# Altium project MIL_STD_1275D_PROTECTION.PrjPcb (part 2 of 4)
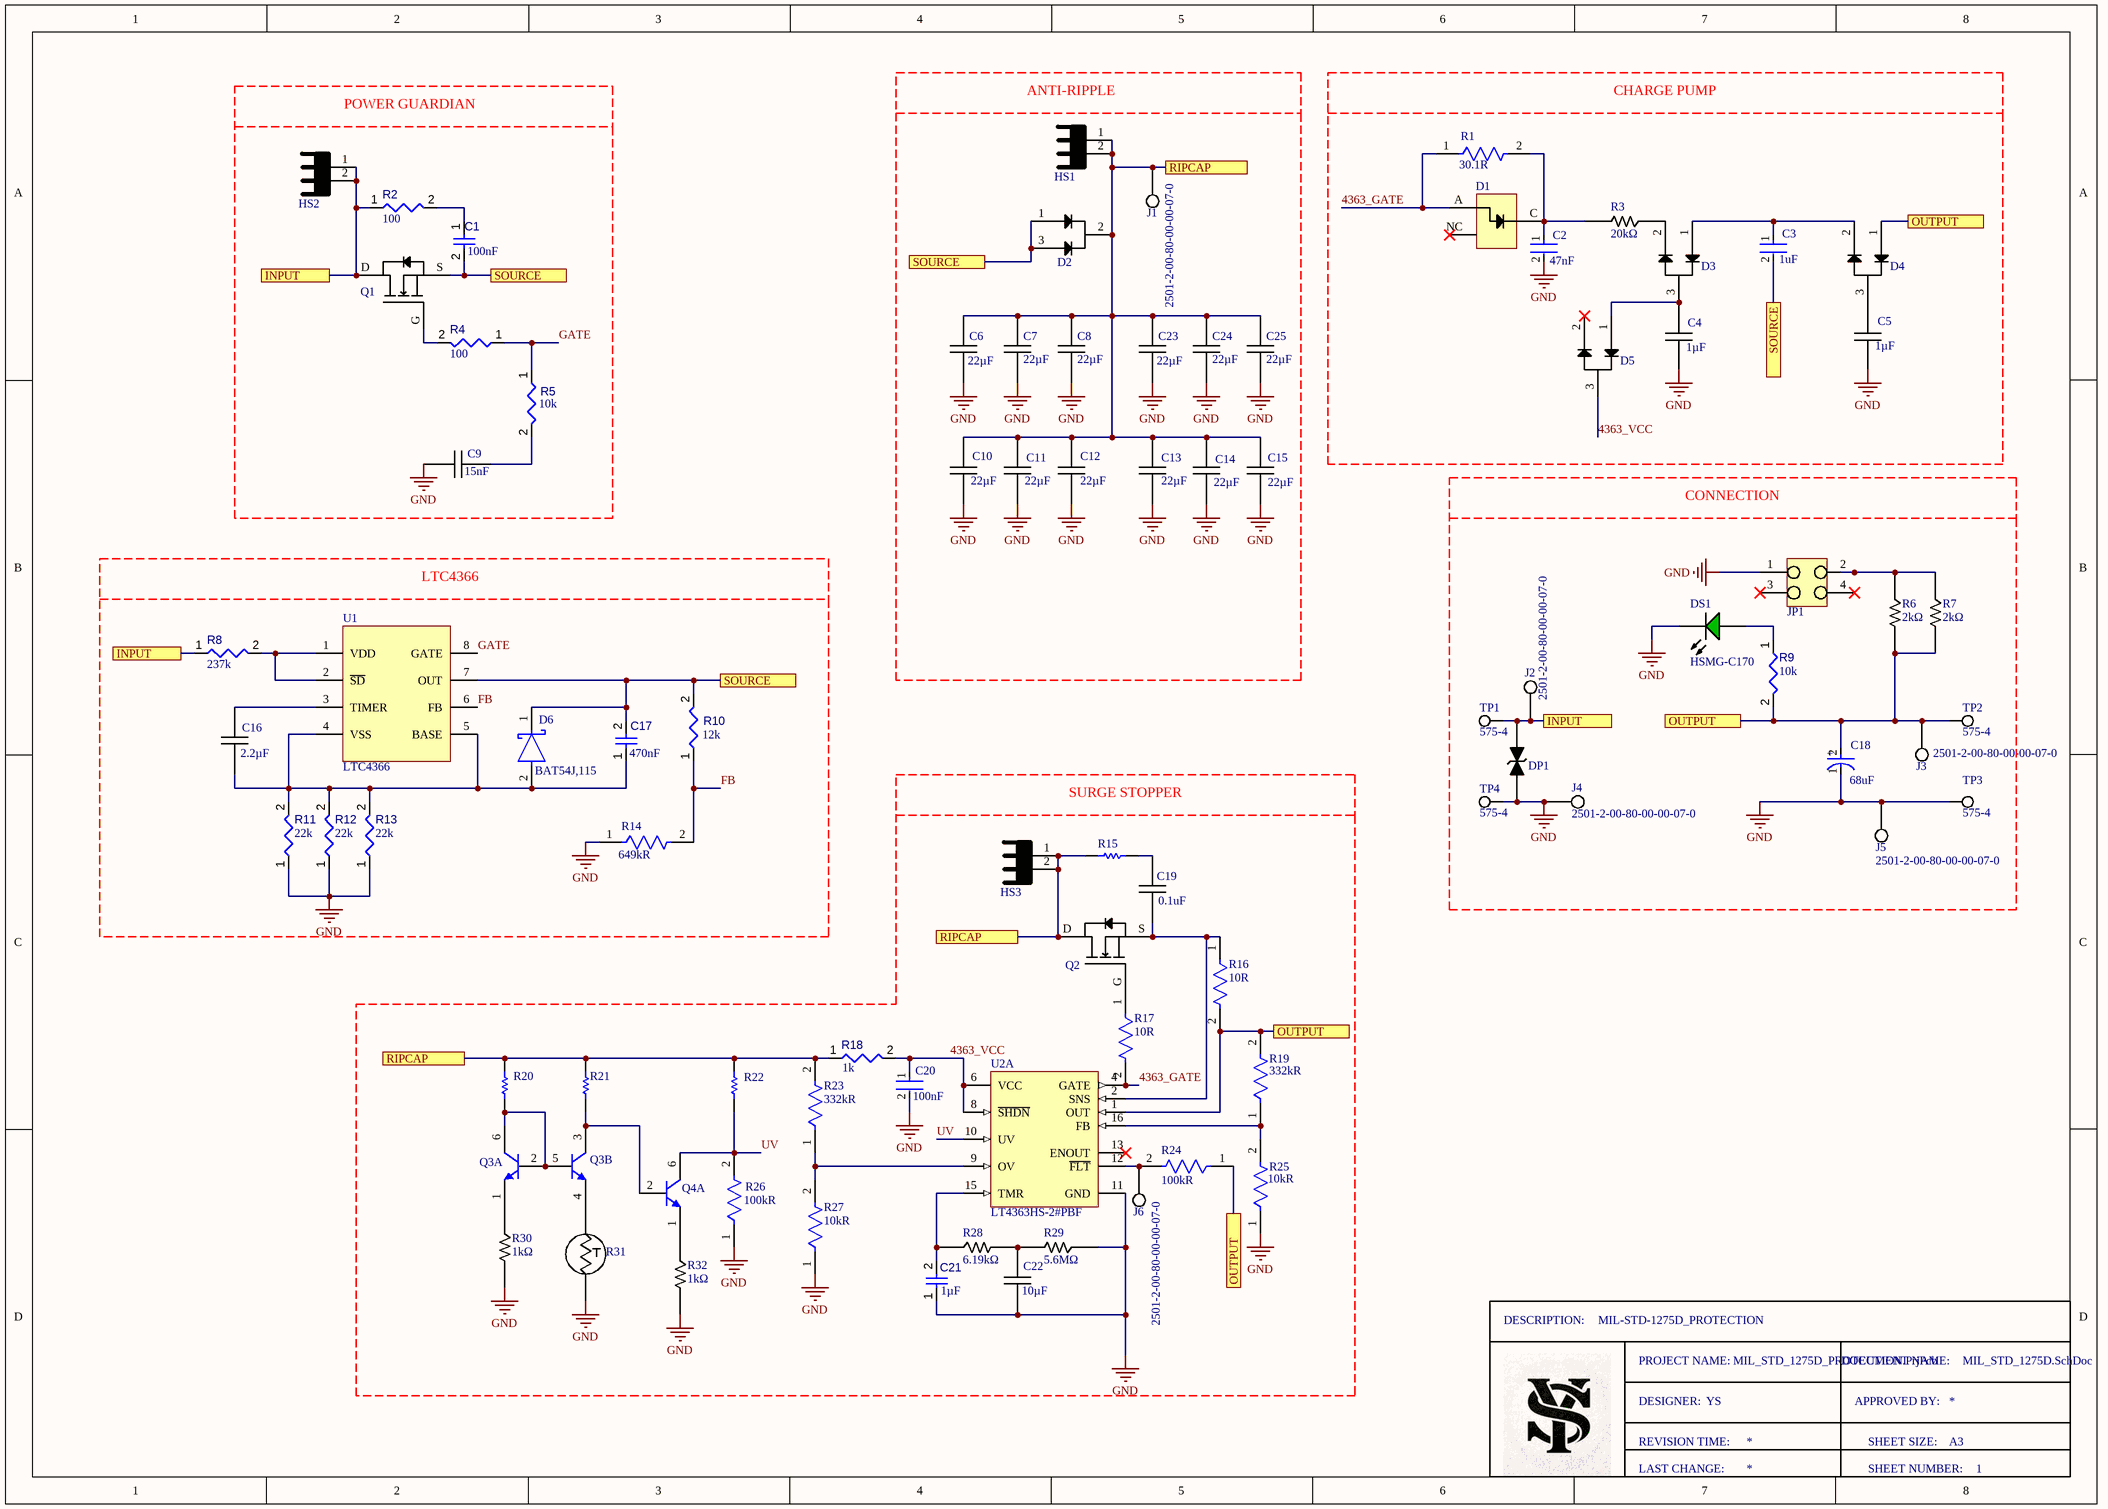
[diagram p1: MIL_STD_1275D.SchDoc]

## Sheet MIL_STD_1275D.SchDoc: MIL-STD-1275D_PROTECTION (continued)
### Library data of the parts
C1 = CMP-001-00065-4: Chip Capacitor, 100nF +/-20%, 25V, 0402, Thickness 0.6 mm; Tolerance: 10%; Max Operating Temperature: 85°C; Min Operating Temperature: -55°C; Pins: 2; Voltage Rating: 25V; Mounting Technology: SMT; Case/Package: 0402
C2 = CMP-08246-006986-1: Multilayer Ceramic Capacitors 47nF ±10% 100V X7R SMD 0805; Height: 1.25mm; Thickness: 0.057inch; Series: C; Case Code (Imperial): 0805; Voltage: 100V; Number of Pins: 2; Termination: SMD/SMT; Lead Free: Lead Free; Package Quantity: 1; Packaging: Tape and Reel; Dielectric: X7R; Resistor Type: Ceramic; RoHS Compliant: Yes; Case Code (Metric): 2012; REACH SVHC: No SVHC; Length: 2mm; Mount: Surface Mount; Depth: 1.25mm; Voltage Rating: 100V; Voltage Rating (DC): 100V; Case/Package: 0805; Tolerance: 10%; Weight: 0.000194oz; Min Operating Temperature: -55°C; Width: 0.049inch; Max Operating Temperature: 125°C
C3 = CMP-08246-007020-1: Multilayer Ceramic Capacitors 1uF ±10% 250V X7R SMD 2220; Voltage Rating (DC): 250V; Case Code (Metric): 5750; Min Operating Temperature: -55°C; REACH SVHC: No SVHC; Max Operating Temperature: 125°C; Height: 2.3mm; Voltage Rating: 250V; Dielectric: X7R; Lead Free: Lead Free; Number of Pins: 2; Termination: SMD/SMT; Length: 5.7mm; Case Code (Imperial): 2220; Mount: Surface Mount; Width: 0.197inch; RoHS Compliant: Yes; Thickness: 0.098inch; Radiation Hardening: No; Tolerance: 10%; Weight: 0.016932oz; Voltage: 250V; Package Quantity: 1; Packaging: Tape and Reel; Resistor Type: Ceramic; Case/Package: 2220; Series: C; Depth: 5mm
C4 C5 = C5750X7R2E105K230KA: 250V 1uF X7R 卤10% 2220 Multilayer Ceramic Capacitors MLCC - SMD/SMT ROHS; Manufacturer: TDK; Manufacturer Lifecycle Status: PRODUCTION; Tolerance: 10%; Designed by: YS; Supplier: Mouser; Supplier Part Number: 810-C5750X7R2E105K; Manufacturer Part Number: C5750X7R2E105K230KA; RoHS: Compliant; Category: Ceramic Capacitors; Stock: 10975; Pricing: 1=1,18, 10=0,601, 50=0,601, 100=0,55, 1000=0,411, 10000=0,38 (USD); Case/Package: 2220; Case Code (Imperial): 2220; Case Code (Metric): 5750; China RoHS: Compliant; Composition: Ceramic; Depth: 5mm; Dielectric: X7R; Dielectric Material: Ceramic; Height: 2.3mm; Lead Free: Lead Free; Length: 5.7mm; Lifecycle Status: Production; Material: Ceramic; Max Length: 6.1mm; Max Operating Temperature: 125°C; Max Width: 5.4mm; Min Length: 5.3mm; Min Operating Temperature: -55°C; Min Width: 4.6mm; Mounting Technology: Surface Mount; Pins: 2; Number of Terminals: 2; Radiation Hardening: No; REACH SVHC: Yes; Schedule B: 8532240020, 8532240020|8532240020|8532240020|8532240020|8532240020; Termination: SMD/SMT; Thickness: 2.4892mm; Voltage: 250V; Voltage Rating: 250V; Voltage Rating (DC): 250V; Weight: 480.014126mg; Width: 5mm; ComponentLink1URL: https://datasheet.octopart.com:443/C5750X7R2E105K230KA-TDK-datasheet-159617022.pdf?src-supplier=IHS; ComponentLink1Description: https://datasheet.octopart.com:443/C5750X7R2E105K230KA-TDK-datasheet-159617022.pdf?src-supplier=IHS; ComponentLink2URL: https://datasheet.octopart.com:443/C5750X7R2E105K230KA-TDK-datasheet-151546522.pdf?src-supplier=TDK; ComponentLink2Description: https://datasheet.octopart.com:443/C5750X7R2E105K230KA-TDK-datasheet-151546522.pdf?src-supplier=TDK; ComponentLink3URL: https://datasheet.octopart.com:443/C5750X7R2E105K230KA-TDK-datasheet-43914167.pdf?src-supplier=Newark; ComponentLink3Description: https://datasheet.octopart.com:443/C5750X7R2E105K230KA-TDK-datasheet-43914167.pdf?src-supplier=Newark; ComponentLink4URL: https://datasheet.octopart.com:443/C5750X7R2E105K230KA-TDK-datasheet-13376850.pdf?src-supplier=Newark; ComponentLink4Description: https://datasheet.octopart.com:443/C5750X7R2E105K230KA-TDK-datasheet-13376850.pdf?src-supplier=Newark; ComponentLink5URL: https://datasheet.octopart.com:443/C5750X7R2E105K230KA-TDK-datasheet-41194876.pdf?src-supplier=Newark; ComponentLink5Description: https://datasheet.octopart.com:443/C5750X7R2E105K230KA-TDK-datasheet-41194876.pdf?src-supplier=Newark; ComponentLink6URL: https://datasheet.octopart.com:443/C5750X7R2E105K230KA-TDK-datasheet-8852320.pdf?src-supplier=Newark; ComponentLink6Description: https://datasheet.octopart.com:443/C5750X7R2E105K230KA-TDK-datasheet-8852320.pdf?src-supplier=Newark; ComponentLink7URL: https://datasheet.octopart.com:443/C5750X7R2E105K230KA-TDK-datasheet-10497308.pdf?src-supplier=Newark; ComponentLink7Description: https://datasheet.octopart.com:443/C5750X7R2E105K230KA-TDK-datasheet-10497308.pdf?src-supplier=Newark; ComponentLink8URL: https://datasheet.octopart.com:443/C5750X7R2E105K230KA-TDK-datasheet-11980753.pdf?src-supplier=element14+APAC; ComponentLink8Description: https://datasheet.octopart.com:443/C5750X7R2E105K230KA-TDK-datasheet-11980753.pdf?src-supplier=element14+APAC; ComponentLink9URL: https://datasheet.octopart.com:443/C5750X7R2E105K230KA-TDK-datasheet-182135025.pdf?src-supplier=TME; ComponentLink9Description: https://datasheet.octopart.com:443/C5750X7R2E105K230KA-TDK-datasheet-182135025.pdf?src-supplier=TME; ComponentLink10URL: https://datasheet.octopart.com:443/C5750X7R2E105K230KA-TDK-datasheet-154543791.pdf?src-supplier=ODG+(Origin+Data+Global); ComponentLink10Description: https://datasheet.octopart.com:443/C5750X7R2E105K230KA-TDK-datasheet-154543791.pdf?src-supplier=ODG+(Origin+Data+Global); ComponentLink11URL: https://datasheet.octopart.com:443/C5750X7R2E105K230KA-TDK-datasheet-12509848.pdf?src-supplier=Future+Electronics; ComponentLink11Description: https://datasheet.octopart.com:443/C5750X7R2E105K230KA-TDK-datasheet-12509848.pdf?src-supplier=Future+Electronics; ComponentLink12URL: https://datasheet.octopart.com:443/C5750X7R2E105K230KA-TDK-datasheet-10978788.pdf?src-supplier=Future+Electronics; ComponentLink12Description: https://datasheet.octopart.com:443/C5750X7R2E105K230KA-TDK-datasheet-10978788.pdf?src-supplier=Future+Electronics; ComponentLink13URL: https://datasheet.octopart.com:443/C5750X7R2E105K230KA-TDK-datasheet-8359770.pdf?src-supplier=Future+Electronics; ComponentLink13Description: https://datasheet.octopart.com:443/C5750X7R2E105K230KA-TDK-datasheet-8359770.pdf?src-supplier=Future+Electronics; ComponentLink14URL: https://datasheet.octopart.com:443/C5750X7R2E105K230KA-TDK-datasheet-8324322.pdf?src-supplier=Future+Electronics; ComponentLink14Description: https://datasheet.octopart.com:443/C5750X7R2E105K230KA-TDK-datasheet-8324322.pdf?src-supplier=Future+Electronics; ComponentLink15URL: https://datasheet.octopart.com:443/C5750X7R2E105K230KA-TDK-datasheet-128946.pdf?src-supplier=Future+Electronics; ComponentLink15Description: https://datasheet.octopart.com:443/C5750X7R2E105K230KA-TDK-datasheet-128946.pdf?src-supplier=Future+Electronics
C6-C8 C10-C15 C23-C25 = CKG57NX7S2A226M500JH: Multilayer Ceramic Capacitor, CKG Series, 22 - F, - 20%, X7S, 100 V, 2220 [5750 Metric]; Manufacturer: TDK; Manufacturer Lifecycle Status: PRODUCTION; Lead/Base Style: L-Lead; Voltage: 100V; Designed by: YS; Supplier: Mouser; Supplier Part Number: 810-CKG57NX7S2A226M; Manufacturer Part Number: CKG57NX7S2A226M500JH; RoHS: Compliant; Category: Ceramic Capacitors; Stock: 54021; Pricing: 1=4,98, 10=3,59, 50=3,04, 100=2,87, 1000=2,41, 10000=2,3 (USD); Case/Package: 2420; Case Code (Imperial): 2220; Case Code (Metric): 5750; China RoHS: Compliant; Composition: Ceramic; Country of Origin: Japan; Depth: 5mm; Dielectric: X7S; Dielectric Material: Ceramic; Export Control Classification Number (ECCN) Code: EAR99; Height: 5mm; Harmonized Tariff Schedule (HTS) Code: 8532.24.00.20; Introduction Date: 2012-12-22; Lead Free: Lead Free; Length: 6mm; Lifecycle Status: Production; Material: Ceramic; Max Length: 6.5mm; Max Operating Temperature: 125°C; Max Width: 5.5mm; Min Length: 5.5mm; Min Operating Temperature: -55°C; Min Width: 4.5mm; Mounting Technology: Surface Mount; Pins: 2; Number of Terminals: 2; REACH SVHC: Yes; Schedule B: 8532230020; Termination: Metal; Thickness: 5.5118mm; Tolerance: 20%; Voltage Rating: 100V; Voltage Rating (DC): 100V; Width: 5mm; ComponentLink1URL: https://datasheet.octopart.com:443/CKG57NX7S2A226M500JH-TDK-datasheet-182135362.pdf?src-supplier=IHS; ComponentLink1Description: https://datasheet.octopart.com:443/CKG57NX7S2A226M500JH-TDK-datasheet-182135362.pdf?src-supplier=IHS; ComponentLink2URL: https://datasheet.octopart.com:443/CKG57NX7S2A226M500JH-TDK-datasheet-151704564.pdf?src-supplier=ODG+(Origin+Data+Global); ComponentLink2Description: https://datasheet.octopart.com:443/CKG57NX7S2A226M500JH-TDK-datasheet-151704564.pdf?src-supplier=ODG+(Origin+Data+Global); ComponentLink3URL: https://datasheet.octopart.com:443/CKG57NX7S2A226M500JH-TDK-datasheet-82998625.pdf?src-supplier=Newark; ComponentLink3Description: https://datasheet.octopart.com:443/CKG57NX7S2A226M500JH-TDK-datasheet-82998625.pdf?src-supplier=Newark; ComponentLink4URL: https://datasheet.octopart.com:443/CKG57NX7S2A226M500JH-TDK-datasheet-12519742.pdf?src-supplier=Newark; ComponentLink4Description: https://datasheet.octopart.com:443/CKG57NX7S2A226M500JH-TDK-datasheet-12519742.pdf?src-supplier=Newark; ComponentLink5URL: https://datasheet.octopart.com:443/CKG57NX7S2A226M500JH-TDK-datasheet-59875343.pdf?src-supplier=Newark; ComponentLink5Description: https://datasheet.octopart.com:443/CKG57NX7S2A226M500JH-TDK-datasheet-59875343.pdf?src-supplier=Newark; ComponentLink6URL: https://datasheet.octopart.com:443/CKG57NX7S2A226M500JH-TDK-datasheet-13376850.pdf?src-supplier=Newark; ComponentLink6Description: https://datasheet.octopart.com:443/CKG57NX7S2A226M500JH-TDK-datasheet-13376850.pdf?src-supplier=Newark; ComponentLink7URL: https://datasheet.octopart.com:443/CKG57NX7S2A226M500JH-TDK-datasheet-23682788.pdf?src-supplier=Newark; ComponentLink7Description: https://datasheet.octopart.com:443/CKG57NX7S2A226M500JH-TDK-datasheet-23682788.pdf?src-supplier=Newark; ComponentLink8URL: https://datasheet.octopart.com:443/CKG57NX7S2A226M500JH-TDK-datasheet-159617030.pdf?src-supplier=TME; ComponentLink8Description: https://datasheet.octopart.com:443/CKG57NX7S2A226M500JH-TDK-datasheet-159617030.pdf?src-supplier=TME; ComponentLink9URL: https://datasheet.octopart.com:443/CKG57NX7S2A226M500JH-TDK-datasheet-165627653.pdf?src-supplier=Burklin+Elektronik; ComponentLink9Description: https://datasheet.octopart.com:443/CKG57NX7S2A226M500JH-TDK-datasheet-165627653.pdf?src-supplier=Burklin+Elektronik; ComponentLink10URL: https://datasheet.octopart.com:443/CKG57NX7S2A226M500JH-TDK-datasheet-42202261.pdf?src-supplier=Electro+Sonic; ComponentLink10Description: https://datasheet.octopart.com:443/CKG57NX7S2A226M500JH-TDK-datasheet-42202261.pdf?src-supplier=Electro+Sonic
C9 = C1206C153K1RACTU (2): Cap Ceramic 0.015uF 100V X7R 10% Pad SMD 1206 125C T/R; Manufacturer: Yageo Group; Dissipation Factor: 2.5%; Designed by: YS; Breakdown Voltage: 150.5V; Clamping Voltage: 207V; Direction: Bidirectional; Element Configuration: Single; Leakage Current: 1µA; Max Breakdown Voltage: 158V; Max Power Dissipation: 5W; Max Surge Current: 100A; Min Breakdown Voltage: 143V; Number of Channels: 1; Operating Supply Voltage: 128V; Peak Pulse Current: 2.9A; Peak Pulse Power: 600W; Test Current: 1mA; Supplier: Mouser; Supplier Part Number: 80-C1206C153K1R; Manufacturer Part Number: C1206C153K1RACTU; RoHS: Compliant; Category: Ceramic Capacitors; Stock: 10900; Pricing: 1=0,32, 10=0,117, 50=0,117, 100=0,08, 1000=0,072, 10000=0,047 (USD); Case/Package: 1206; Case Code (Imperial): 1206; Case Code (Metric): 3216; China RoHS: Compliant; Country of Origin: Mexico; Depth: 1.6mm; Dielectric: X7R; Dielectric Material: Ceramic; Export Control Classification Number (ECCN) Code: EAR99; Height: 780µm; Harmonized Tariff Schedule (HTS) Code: 8532.24.00.20; Introduction Date: 2008-01-10; Length: 3.2mm; Lifecycle Status: Production; Material: Ceramic; Max Operating Temperature: 125°C; Min Operating Temperature: -55°C; Mounting Technology: Surface Mount; Number of Terminals: 2; REACH SVHC: Yes; Termination: SMD/SMT; Thickness: 889µm; Tolerance: 10%; Voltage Rating: 100V; Voltage Rating (DC): 100V; Width: 1.6mm; ComponentLink1URL: https://datasheet.octopart.com:443/C1206C153K1RACTU-KEMET-datasheet-178445679.pdf?src-supplier=IHS; ComponentLink1Description: https://datasheet.octopart.com:443/C1206C153K1RACTU-KEMET-datasheet-178445679.pdf?src-supplier=IHS; ComponentLink2URL: https://datasheet.octopart.com:443/C1206C153K1RACTU-KEMET-datasheet-137357759.pdf?src-supplier=Farnell; ComponentLink2Description: https://datasheet.octopart.com:443/C1206C153K1RACTU-KEMET-datasheet-137357759.pdf?src-supplier=Farnell; ComponentLink3URL: https://datasheet.octopart.com:443/C1206C153K1RACTU-KEMET-datasheet-149525345.pdf?src-supplier=Farnell; ComponentLink3Description: https://datasheet.octopart.com:443/C1206C153K1RACTU-KEMET-datasheet-149525345.pdf?src-supplier=Farnell; ComponentLink4URL: https://datasheet.octopart.com:443/C1206C153K1RACTU-KEMET-datasheet-138896532.pdf?src-supplier=Upverter; ComponentLink4Description: https://datasheet.octopart.com:443/C1206C153K1RACTU-KEMET-datasheet-138896532.pdf?src-supplier=Upverter; ComponentLink5URL: https://datasheet.octopart.com:443/C1206C153K1RACTU-KEMET-datasheet-37550250.pdf?src-supplier=Electro+Sonic; ComponentLink5Description: https://datasheet.octopart.com:443/C1206C153K1RACTU-KEMET-datasheet-37550250.pdf?src-supplier=Electro+Sonic; ComponentLink6URL: https://datasheet.octopart.com/C1206C153K1RACTU-KEMET-datasheet-84169754.pdf; ComponentLink6Description: https://datasheet.octopart.com/C1206C153K1RACTU-KEMET-datasheet-84169754.pdf; ComponentLink7URL: https://datasheet.octopart.com:443/C1206C153K1RACTU-Kemet-datasheet-11546808.pdf?src-supplier=Arrow+Electronics; ComponentLink7Description: https://datasheet.octopart.com:443/C1206C153K1RACTU-Kemet-datasheet-11546808.pdf?src-supplier=Arrow+Electronics; Max Reverse Leakage Current: 1µA; Number of Elements: 1; Pins: 2; Packaging: Tape & Reel; Peak Reverse Current: 1µA; Polarity: Bidirectional; Radiation Hardening: No; Reverse Breakdown Voltage: 143V; Reverse Standoff Voltage: 128V; Schedule B: 8541100080, 8541100080|8541100080|8541100080|8541100080|8541100080; ComponentLink8URL: https://datasheet.octopart.com:443/P6SMB150CA-E3-52-Vishay-datasheet-181470445.pdf?src-supplier=IHS; ComponentLink8Description: https://datasheet.octopart.com:443/P6SMB150CA-E3-52-Vishay-datasheet-181470445.pdf?src-supplier=IHS; ComponentLink9URL: https://datasheet.octopart.com:443/P6SMB150CA-E3-52-Vishay-datasheet-188933141.pdf?src-supplier=TME; ComponentLink9Description: https://datasheet.octopart.com:443/P6SMB150CA-E3-52-Vishay-datasheet-188933141.pdf?src-supplier=TME; ComponentLink10URL: https://datasheet.octopart.com:443/P6SMB150CA-E3-52-Vishay-datasheet-120074524.pdf?src-supplier=TME; ComponentLink10Description: https://datasheet.octopart.com:443/P6SMB150CA-E3-52-Vishay-datasheet-120074524.pdf?src-supplier=TME; ComponentLink11URL: https://datasheet.octopart.com:443/P6SMB150CA-E3-52-Vishay-datasheet-49916473.pdf?src-supplier=TME; ComponentLink11Description: https://datasheet.octopart.com:443/P6SMB150CA-E3-52-Vishay-datasheet-49916473.pdf?src-supplier=TME; ComponentLink12URL: https://datasheet.octopart.com:443/P6SMB150CA-E3-52-Vishay-datasheet-101751612.pdf?src-supplier=Future+Electronics; ComponentLink12Description: https://datasheet.octopart.com:443/P6SMB150CA-E3-52-Vishay-datasheet-101751612.pdf?src-supplier=Future+Electronics; ComponentLink13URL: http://sigma.octopart.com:80/rohs_statement/Vishay-company-15.pdf?src-supplier=Compliance+Statements; ComponentLink13Description: http://sigma.octopart.com:80/rohs_statement/Vishay-company-15.pdf?src-supplier=Compliance+Statements
C16 = CGA4J3X7R1E225K125AB: 25V 2.2uF X7R ±10% 0805 Multilayer Ceramic Capacitors MLCC - SMD/SMT ROHS; Manufacturer: TDK; Manufacturer Lifecycle Status: PRODUCTION; Manufacturer Package Identifier: 0805 (2012 metric); Designed by: YS; Supplier: Mouser; Supplier Part Number: 810-CGA4J3X7R1E225K; Manufacturer Part Number: CGA4J3X7R1E225K125AB; RoHS: Compliant; Category: Ceramic Capacitors; Stock: 62462; Pricing: 1=0,43, 10=0,202, 50=0,202, 100=0,171, 1000=0,133, 10000=0,109 (USD); Case/Package: 0805; Case Code (Imperial): 0805; Case Code (Metric): 2012; China RoHS: Compliant; Composition: Ceramic; Country of Origin: Japan; Depth: 1.25mm; Dielectric: X7R; Dielectric Material: Ceramic; Export Control Classification Number (ECCN) Code: EAR99; Height: 1.25mm; Harmonized Tariff Schedule (HTS) Code: 8532.24.00.20; Introduction Date: 2012-12-22; Length: 2mm; Lifecycle Status: Production; Material: Ceramic; Max Length: 2.2mm; Max Operating Temperature: 125°C; Max Width: 1.45mm; Min Length: 1.8mm; Min Operating Temperature: -55°C; Min Width: 1.05mm; Mounting Technology: Surface Mount; Number of Terminals: 2; Ratings: AEC-Q200; REACH SVHC: Yes; Schedule B: 8532240020, 8532240020|8532240020|8532240020|8532240020|8532240020; Termination: SMD/SMT; Thickness: 1.4478mm; Tolerance: 10%; Voltage Rating: 25V; Voltage Rating (DC): 25V; Weight: 5.499807mg; Width: 1.25mm; ComponentLink1URL: https://datasheet.octopart.com:443/CGA4J3X7R1E225K125AB-TDK-datasheet-165583812.pdf?src-supplier=IHS; ComponentLink1Description: https://datasheet.octopart.com:443/CGA4J3X7R1E225K125AB-TDK-datasheet-165583812.pdf?src-supplier=IHS; ComponentLink2URL: https://datasheet.octopart.com:443/CGA4J3X7R1E225K125AB-TDK-datasheet-138890726.pdf?src-supplier=Upverter; ComponentLink2Description: https://datasheet.octopart.com:443/CGA4J3X7R1E225K125AB-TDK-datasheet-138890726.pdf?src-supplier=Upverter; ComponentLink3URL: https://datasheet.octopart.com:443/CGA4J3X7R1E225K125AB-TDK-datasheet-151546526.pdf?src-supplier=ODG+(Origin+Data+Global); ComponentLink3Description: https://datasheet.octopart.com:443/CGA4J3X7R1E225K125AB-TDK-datasheet-151546526.pdf?src-supplier=ODG+(Origin+Data+Global); ComponentLink4URL: https://datasheet.octopart.com:443/CGA4J3X7R1E225K125AB-TDK-datasheet-159510193.pdf?src-supplier=Newark; ComponentLink4Description: https://datasheet.octopart.com:443/CGA4J3X7R1E225K125AB-TDK-datasheet-159510193.pdf?src-supplier=Newark; ComponentLink5URL: https://datasheet.octopart.com:443/CGA4J3X7R1E225K125AB-TDK-datasheet-37140110.pdf?src-supplier=Newark; ComponentLink5Description: https://datasheet.octopart.com:443/CGA4J3X7R1E225K125AB-TDK-datasheet-37140110.pdf?src-supplier=Newark; ComponentLink6URL: https://datasheet.octopart.com:443/CGA4J3X7R1E225K125AB-TDK-datasheet-43366117.pdf?src-supplier=Newark; ComponentLink6Description: https://datasheet.octopart.com:443/CGA4J3X7R1E225K125AB-TDK-datasheet-43366117.pdf?src-supplier=Newark; ComponentLink7URL: https://datasheet.octopart.com:443/CGA4J3X7R1E225K125AB.-TDK-datasheet-33009218.pdf?src-supplier=Newark; ComponentLink7Description: https://datasheet.octopart.com:443/CGA4J3X7R1E225K125AB.-TDK-datasheet-33009218.pdf?src-supplier=Newark; ComponentLink8URL: https://datasheet.octopart.com:443/CGA4J3X7R1E225K125AB-TDK-datasheet-140571036.pdf?src-supplier=Arrow.cn; ComponentLink8Description: https://datasheet.octopart.com:443/CGA4J3X7R1E225K125AB-TDK-datasheet-140571036.pdf?src-supplier=Arrow.cn
C17 = CMP-001-00077-3: Chip Capacitor, 470nF +/-20%, 25V, 0603, Thickness 1 mm; Tolerance: 10%; Max Operating Temperature: 85°C; Voltage Rating: 25V; Pins: 2; Case/Package: 0603; Mounting Technology: SMT; Min Operating Temperature: -55°C
C18 = CMP-05428-000631-1: Conductive Polymer Aluminum Solid Capacitors (OS-CON) 68uF ±20% 50V RADIAL SMT 10x12.6mm; Leakage Current: 680uA; Life (Hours): 5000Hour; Dissipation Factor: 12%; Ripple Current (AC): 4.3A; ESR (Equivalent Series Resistance): 20mR; Polarity: Polar; Diameter: 10mm; Min Operating Temperature: -55°C; Construction: Cylindrical; Tolerance: 20%; Voltage Rating: 50V; Case/Package: Radial; Mount: Surface Mount; Max Operating Temperature: 105°C; RoHS Compliant: Yes; Height - Seated (Max): 0.5inch; Termination: SMD/SMT; Voltage Rating (DC): 50V; Packaging: Tape and Reel; Length: 12.6mm; Package Quantity: 400; Number of Pins: 12; Lead Free: Lead Free; Height: 12.6mm; REACH SVHC: No SVHC; Ripple Current: 4.3A; Series: OS-CON™, SVPF; Voltage: 50V
C19 = C1210C104K1RAC7025 Yageo Group: SMD Comm X7R 1210 (3225Metric) ceramic capacitor 0.126Lx0.098W 3.20mmx2.50mm X7R ±10% 0.1muF
C20 = CMP-08246-005364-1: Multilayer Ceramic Capacitors 100nF ±10% 100V X7R SMD 0805; Packaging: Tape and Reel; Length: 2mm; Number of Pins: 2; Voltage Rating: 100V; Min Operating Temperature: -55°C; Height: 1.25mm; Radiation Hardening: No; Termination: SMD/SMT; Weight: 0.000194oz; Case Code (Imperial): 0805; Max Operating Temperature: 125°C; Voltage: 100V; Thickness: 0.057inch; Width: 0.049inch; Resistor Type: Ceramic; Package Quantity: 1; Tolerance: 10%; Mount: Surface Mount; Depth: 1.25mm; Series: C; Lead Free: Lead Free; Case/Package: 0805; Voltage Rating (DC): 100V; Dielectric: X7R; Case Code (Metric): 2012; RoHS Compliant: Yes; REACH SVHC: No SVHC; Construction: Flat
C21 = CMP-001-00004-6: Chip Capacitor, 1 uF, +/- 10%, 16 V, 0603 (1608 Metric); Capacitor Type: Ceramic; Mounting Technology: SM; RoHS Compliant: True; Min Operating Temperature: -55°C; Case/Package: 0603; Pins: 2; Voltage Rating: 16V; Max Operating Temperature: 125°C; Tolerance: 10%
C22 = CL21B106KOQNNNE: 16V 10uF X7R 卤10% 0805 Multilayer Ceramic Capacitors MLCC - SMD/SMT ROHS; Manufacturer: Samsung Electro-Mechanics; Tolerance: 10%; Designed by: YS; Supplier: Mouser; Supplier Part Number: 187-CL21B106KOQNNNE; Manufacturer Part Number: CL21B106KOQNNNE; RoHS: Compliant; Category: Ceramic Capacitors; Stock: 529185; Pricing: 1=0,17, 10=0,056, 50=0,056, 100=0,056, 1000=0,054, 10000=0,038 (USD); Case/Package: 0805; Case Code (Imperial): 0805; Case Code (Metric): 2012; China RoHS: Compliant; Contact Plating: Tin; Country of Origin: Mainland China, Philippines, South Korea; Depth: 1.25mm; Dielectric: X7R; Dielectric Material: Ceramic; Export Control Classification Number (ECCN) Code: EAR99; Height: 1.4mm; Harmonized Tariff Schedule (HTS) Code: 8532.24.00.20; Introduction Date: 2010-04-09; Length: 2mm; Lifecycle Status: Production; Material: Ceramic; Max Operating Temperature: 125°C; Min Operating Temperature: -55°C; Mounting Technology: Surface Mount; Number of Terminals: 2; Radiation Hardening: No; REACH SVHC: Yes; Schedule B: 8532240020, 8532240020|8532240020, 8532240020|8532240020|8532240020, 8532240020|8532240020|8532240020|8532240020; Thickness: 1.397mm; Voltage: 16V; Voltage Rating: 16V; Voltage Rating (DC): 16V; Width: 1.25mm; ComponentLink1URL: https://datasheet.octopart.com:443/CL21B106KOQNNNE-Samsung-Electro-Mechanics-datasheet-136482503.pdf?src-supplier=IHS; ComponentLink1Description: https://datasheet.octopart.com:443/CL21B106KOQNNNE-Samsung-Electro-Mechanics-datasheet-136482503.pdf?src-supplier=IHS; ComponentLink2URL: https://datasheet.octopart.com:443/CL21B106KOQNNNE-Samsung-Electro-Mechanics-datasheet-116891046.pdf?src-supplier=Future+Electronics; ComponentLink2Description: https://datasheet.octopart.com:443/CL21B106KOQNNNE-Samsung-Electro-Mechanics-datasheet-116891046.pdf?src-supplier=Future+Electronics; ComponentLink3URL: https://datasheet.octopart.com:443/CL21B106KOQNNNE-Samsung-Electro-Mechanics-datasheet-81462191.pdf?src-supplier=Future+Electronics; ComponentLink3Description: https://datasheet.octopart.com:443/CL21B106KOQNNNE-Samsung-Electro-Mechanics-datasheet-81462191.pdf?src-supplier=Future+Electronics; ComponentLink4URL: https://datasheet.octopart.com:443/CL21B106KOQNNNE-Samsung-datasheet-12530662.pdf?src-supplier=Future+Electronics; ComponentLink4Description: https://datasheet.octopart.com:443/CL21B106KOQNNNE-Samsung-datasheet-12530662.pdf?src-supplier=Future+Electronics; ComponentLink5URL: https://datasheet.octopart.com:443/CL21B106KOQNNNE-Samsung-datasheet-26669285.pdf?src-supplier=Future+Electronics; ComponentLink5Description: https://datasheet.octopart.com:443/CL21B106KOQNNNE-Samsung-datasheet-26669285.pdf?src-supplier=Future+Electronics; ComponentLink6URL: https://datasheet.octopart.com:443/CL21B106KOQNNNE-Samsung-Electro-Mechanics-datasheet-149045986.pdf?src-supplier=Future+Electronics; ComponentLink6Description: https://datasheet.octopart.com:443/CL21B106KOQNNNE-Samsung-Electro-Mechanics-datasheet-149045986.pdf?src-supplier=Future+Electronics; ComponentLink7URL: https://datasheet.octopart.com/CL21B106KOQNNNE-Samsung-Electro-Mechanics-datasheet-97040617.pdf; ComponentLink7Description: https://datasheet.octopart.com/CL21B106KOQNNNE-Samsung-Electro-Mechanics-datasheet-97040617.pdf; ComponentLink8URL: https://datasheet.octopart.com/CL21B106KOQNNNE-Samsung-Electro-Mechanics-datasheet-8324245.pdf; ComponentLink8Description: https://datasheet.octopart.com/CL21B106KOQNNNE-Samsung-Electro-Mechanics-datasheet-8324245.pdf; ComponentLink9URL: https://datasheet.octopart.com:443/CL21B106KOQNNNE-Samsung-Electro-Mechanics-datasheet-11806859.pdf?src-supplier=Arrow+Electronics; ComponentLink9Description: https://datasheet.octopart.com:443/CL21B106KOQNNNE-Samsung-Electro-Mechanics-datasheet-11806859.pdf?src-supplier=Arrow+Electronics; ComponentLink10URL: https://datasheet.octopart.com:443/CL21B106KOQNNNE-Samsung-datasheet-8326407.pdf?src-supplier=TME; ComponentLink10Description: https://datasheet.octopart.com:443/CL21B106KOQNNNE-Samsung-datasheet-8326407.pdf?src-supplier=TME
D1 = BAS21W-7-F: Rectifier Diode, 1 Phase, 1 Element, 0.2A, 250V V(RRM), Silicon; Manufacturer: Diodes Inc.; Average Rectified Current: 200mA; Value: 5pF; Element Configuration: Single; Forward Voltage: 1V; Max Forward Surge Current (Ifsm): 500mA; Max Power Dissipation: 200mW; Max Repetitive Reverse Voltage (Vrrm): 200V; Max Surge Current: 2.5A; Number of Elements: 1; Peak Reverse Current: 100nA; Polarity: Standard; Recovery Time: 50ns; Supplier: Farnell; Supplier Part Number: BAS21W-7-F; Manufacturer Part Number: BAS21W-7-F; RoHS: Compliant; Category: Rectifier Diodes; Stock: 473; Pricing: 5=0,095, 10=0,0637, 100=0,0551, 500=0,054, 1000=0,0529 (EUR); Case/Package: SOT-323; China RoHS: Compliant; Contact Plating: Tin; Country of Origin: Mainland China; Export Control Classification Number (ECCN) Code: EAR99; Forward Current: 200mA; Height: 1mm; Harmonized Tariff Schedule (HTS) Code: 8541.10.00.70; Introduction Date: 2003-09-19; Lead Free: Lead Free; Length: 2.2mm; Lifecycle Status: Production; Max Operating Temperature: 150°C; Max Output current: 200mA; Max Reverse Voltage (DC): 200V; Min Operating Temperature: -65°C; Mounting Technology: Surface Mount; Pins: 3; Number of Terminals: 3; Output Current: 200mA; Packaging: Cut Tape; Peak Non-Repetitive Surge Current: 2.5A; Power Dissipation: 200mW; Power Rating: 200mW; Radiation Hardening: No; REACH SVHC: Yes; Reverse Recovery Time: 50ns; Reverse Standoff Voltage: 250V; Schedule B: 8541100070, 8541100070|8541100070|8541100070|8541100070|8541100070; Width: 1.35mm; ComponentLink1URL: https://datasheet.octopart.com:443/BAS21W-7-F-Diodes-Inc.-datasheet-159154099.pdf?src-supplier=IHS; ComponentLink1Description: https://datasheet.octopart.com:443/BAS21W-7-F-Diodes-Inc.-datasheet-159154099.pdf?src-supplier=IHS; ComponentLink2URL: https://datasheet.octopart.com:443/BAS21W-7-F-Diodes-Inc.-datasheet-110081012.pdf?src-supplier=Newark; ComponentLink2Description: https://datasheet.octopart.com:443/BAS21W-7-F-Diodes-Inc.-datasheet-110081012.pdf?src-supplier=Newark; ComponentLink3URL: https://datasheet.octopart.com:443/BAS21W-7-F-Diodes-Inc.-datasheet-11045645.pdf?src-supplier=Components+Direct; ComponentLink3Description: https://datasheet.octopart.com:443/BAS21W-7-F-Diodes-Inc.-datasheet-11045645.pdf?src-supplier=Components+Direct; ComponentLink4URL: https://datasheet.octopart.com:443/BAS21W-7-F-Diodes-Inc.-datasheet-41307045.pdf?src-supplier=RS+(Formerly+Allied+Electronics); ComponentLink4Description: https://datasheet.octopart.com:443/BAS21W-7-F-Diodes-Inc.-datasheet-41307045.pdf?src-supplier=RS+(Formerly+Allied+Electronics); ComponentLink5URL: https://sigma.octopart.com:443/138896157/technical_drawing/Diodes-Inc.-BAS21W-7-F.pdf?src-supplier=Diodes+Inc+SCT; ComponentLink5Description: https://sigma.octopart.com:443/138896157/technical_drawing/Diodes-Inc.-BAS21W-7-F.pdf?src-supplier=Diodes+Inc+SCT; ComponentLink6URL: https://datasheet.octopart.com:443/BAS21W-7-F-Diodes-Inc.-datasheet-14054570.pdf?src-supplier=iiiC; ComponentLink6Description: https://datasheet.octopart.com:443/BAS21W-7-F-Diodes-Inc.-datasheet-14054570.pdf?src-supplier=iiiC; ComponentLink7URL: https://datasheet.octopart.com:443/BAS21W-7-F-Diodes-Inc.-datasheet-118416.pdf?src-supplier=DigiKey; ComponentLink7Description: https://datasheet.octopart.com:443/BAS21W-7-F-Diodes-Inc.-datasheet-118416.pdf?src-supplier=DigiKey; ComponentLink8URL: https://datasheet.octopart.com:443/BAS21W-7-F-Diodes-Inc.-datasheet-76978.pdf?src-supplier=Mouser; ComponentLink8Description: https://datasheet.octopart.com:443/BAS21W-7-F-Diodes-Inc.-datasheet-76978.pdf?src-supplier=Mouser
D2 = FEP30GP-E3/45: Rectifier Diode, 1 Phase, 2 Element, 15A, 400V V(RRM), Silicon, TO-247AD; Manufacturer: Vishay; Average Rectified Current: 30A; Value: 175pF; Element Configuration: Common Cathode; Forward Voltage: 1.3V; Max Forward Surge Current (Ifsm): 300A; Max Junction Temperature (Tj): 150°C; Number of Elements: 2; Peak Reverse Current: 10µA; Recovery Time: 50ns; Designed by: YS; Supplier: Mouser; Supplier Part Number: 625-FEP30GP-E3; Manufacturer Part Number: FEP30GP-E3/45; RoHS: Compliant; Category: Rectifier Diodes; Pricing: 1=3,72, 10=2,71, 50=2,71, 100=2,11, 1000=1,61, 10000=1,52 (USD); China RoHS: Non-Compliant; Export Control Classification Number (ECCN) Code: EAR99; Forward Current: 30A; Height: 25.4mm; Harmonized Tariff Schedule (HTS) Code: 8541.10.00.80; Introduction Date: 2006-05-26; Length: 16.4mm; Lifecycle Status: EOL; LTB Date: 2025-06-20; LTD Date: 2025-12-20; Max Operating Temperature: 150°C; Max Output current: 15A; Max Repetitive Reverse Voltage (Vrrm): 400V; Max Reverse Voltage (DC): 400V; Max Surge Current: 300A; Manufacturer Package Identifier: FEP30GP-E3/45; Min Operating Temperature: -55°C; Mounting Technology: Through Hole; Pins: 3; Number of Terminals: 3; Packaging: Bulk; Peak Non-Repetitive Surge Current: 300A; Radiation Hardening: No; REACH SVHC: Yes; Reverse Recovery Time: 50ns; Reverse Standoff Voltage: 400V; Reverse Voltage: 400V; Schedule B: 8541100080, 8541100080|8541100080|8541100080|8541100080|8541100080; Width: 5.16mm; ComponentLink1URL: https://datasheet.octopart.com:443/FEP30GP-E3-45-Vishay-datasheet-181467821.pdf?src-supplier=Newark; ComponentLink1Description: https://datasheet.octopart.com:443/FEP30GP-E3-45-Vishay-datasheet-181467821.pdf?src-supplier=Newark; ComponentLink2URL: https://datasheet.octopart.com:443/FEP30GP-E3-45-Vishay-datasheet-78776706.pdf?src-supplier=Newark; ComponentLink2Description: https://datasheet.octopart.com:443/FEP30GP-E3-45-Vishay-datasheet-78776706.pdf?src-supplier=Newark; ComponentLink3URL: https://datasheet.octopart.com:443/FEP30GP-E3-45-Vishay-datasheet-33014099.pdf?src-supplier=Newark; ComponentLink3Description: https://datasheet.octopart.com:443/FEP30GP-E3-45-Vishay-datasheet-33014099.pdf?src-supplier=Newark; ComponentLink4URL: https://datasheet.octopart.com:443/FEP30GP-E3-45-Vishay-datasheet-27584496.pdf?src-supplier=Upverter; ComponentLink4Description: https://datasheet.octopart.com:443/FEP30GP-E3-45-Vishay-datasheet-27584496.pdf?src-supplier=Upverter; ComponentLink5URL: https://datasheet.octopart.com:443/FEP30GP-E3-45-Vishay-datasheet-11729142.pdf?src-supplier=element14+APAC; ComponentLink5Description: https://datasheet.octopart.com:443/FEP30GP-E3-45-Vishay-datasheet-11729142.pdf?src-supplier=element14+APAC; ComponentLink6URL: https://datasheet.octopart.com:443/FEP30GP-E3-45-Vishay-datasheet-7840971.pdf?src-supplier=element14+APAC; ComponentLink6Description: https://datasheet.octopart.com:443/FEP30GP-E3-45-Vishay-datasheet-7840971.pdf?src-supplier=element14+APAC; ComponentLink7URL: https://datasheet.octopart.com:443/FEP30GP-E3-45-Vishay-datasheet-62318015.pdf?src-supplier=element14+APAC; ComponentLink7Description: https://datasheet.octopart.com:443/FEP30GP-E3-45-Vishay-datasheet-62318015.pdf?src-supplier=element14+APAC; ComponentLink8URL: https://datasheet.octopart.com:443/FEP30GP-E3-45-Vishay-datasheet-27709055.pdf?src-supplier=element14+APAC; ComponentLink8Description: https://datasheet.octopart.com:443/FEP30GP-E3-45-Vishay-datasheet-27709055.pdf?src-supplier=element14+APAC; ComponentLink9URL: https://datasheet.octopart.com:443/FEP30GP-E3/45-Vishay-datasheet-8359725.pdf?src-supplier=Future+Electronics; ComponentLink9Description: https://datasheet.octopart.com:443/FEP30GP-E3/45-Vishay-datasheet-8359725.pdf?src-supplier=Future+Electronics; ComponentLink10URL: http://sigma.octopart.com:80/rohs_statement/Vishay-company-15.pdf?src-supplier=Compliance+Statements; ComponentLink10Description: http://sigma.octopart.com:80/rohs_statement/Vishay-company-15.pdf?src-supplier=Compliance+Statements
D3-D5 = MMBD3004S-7-F: Rectifier Diode Small Signal Switching 350V 0.225A 50ns 3-Pin SOT-23 T/R; Manufacturer: Diodes Inc.; Average Rectified Current: 225mA; Value: 1pF; Forward Voltage: 870mV; Max Forward Surge Current (Ifsm): 4A; Max Junction Temperature (Tj): 150°C; Max Power Dissipation: 350mW; Max Reverse Voltage (DC): 300V; Number of Elements: 2; Peak Reverse Current: 100µA; Reverse Standoff Voltage: 240V; Designed by: YS; Supplier: Farnell; Supplier Part Number: MMBD3004S-7-F; Manufacturer Part Number: MMBD3004S-7-F; RoHS: Compliant; Category: Rectifier Diodes; Pricing: 5=0,297, 10=0,291, 100=0,285, 500=0,279 (EUR); Case/Package: SOT-23; China RoHS: Compliant; Contact Plating: Tin; Country of Origin: Mainland China; Current Rating: 225mA; Export Control Classification Number (ECCN) Code: EAR99; Forward Current: 225mA; Height: 1.1mm; Harmonized Tariff Schedule (HTS) Code: 8541.10.00.70; Introduction Date: 2002-07-26; Lead Free: Lead Free; Length: 3.05mm; Lifecycle Status: Obsolete; LTB Date: 2023-08-22; LTD Date: 2024-02-22; Max Operating Temperature: 150°C; Max Output current: 225mA; Max Repetitive Reverse Voltage (Vrrm): 350V; Max Surge Current: 4A; Min Breakdown Voltage: 350V; Min Operating Temperature: -65°C; Mounting Technology: Surface Mount; Pins: 3; Number of Terminals: 3; Packaging: Cut Tape; Peak Non-Repetitive Surge Current: 4A; Power Dissipation: 350mW; Power Rating: 350mW; Radiation Hardening: No; REACH SVHC: Yes; Recovery Time: 50ns; Reverse Recovery Time: 50ns; Reverse Voltage: 300V; Schedule B: 8541100070, 8541100070|8541100070|8541100070|8541100070|8541100070; Termination: SMD/SMT; Voltage Rating (DC): 300V; Weight: 7.994566mg; Width: 1.4mm; ComponentLink1URL: https://datasheet.octopart.com:443/MMBD3004S-7-F-Diodes-Inc.-datasheet-168181543.pdf?src-supplier=IHS; ComponentLink1Description: https://datasheet.octopart.com:443/MMBD3004S-7-F-Diodes-Inc.-datasheet-168181543.pdf?src-supplier=IHS; ComponentLink2URL: https://datasheet.octopart.com:443/MMBD3004S-7-F-Diodes-Inc.-datasheet-78715965.pdf?src-supplier=Newark; ComponentLink2Description: https://datasheet.octopart.com:443/MMBD3004S-7-F-Diodes-Inc.-datasheet-78715965.pdf?src-supplier=Newark; ComponentLink3URL: https://datasheet.octopart.com:443/MMBD3004S-7-F-Diodes-Inc.-datasheet-12524006.pdf?src-supplier=element14+APAC; ComponentLink3Description: https://datasheet.octopart.com:443/MMBD3004S-7-F-Diodes-Inc.-datasheet-12524006.pdf?src-supplier=element14+APAC; ComponentLink4URL: https://datasheet.octopart.com:443/MMBD3004S-7-F-Diodes-Inc.-datasheet-8399467.pdf?src-supplier=element14+APAC; ComponentLink4Description: https://datasheet.octopart.com:443/MMBD3004S-7-F-Diodes-Inc.-datasheet-8399467.pdf?src-supplier=element14+APAC; ComponentLink5URL: https://datasheet.octopart.com:443/MMBD3004S-7-F-Diodes-Inc.-datasheet-34390452.pdf?src-supplier=RS+(Formerly+Allied+Electronics); ComponentLink5Description: https://datasheet.octopart.com:443/MMBD3004S-7-F-Diodes-Inc.-datasheet-34390452.pdf?src-supplier=RS+(Formerly+Allied+Electronics); ComponentLink6URL: https://datasheet.octopart.com:443/MMBD3004S-7-F-Diodes-Inc.-datasheet-15841.pdf?src-supplier=Mouser; ComponentLink6Description: https://datasheet.octopart.com:443/MMBD3004S-7-F-Diodes-Inc.-datasheet-15841.pdf?src-supplier=Mouser; ComponentLink7URL: https://sigma.octopart.com:443/138706058/technical_drawing/Diodes-Inc.-MMBD3004S-7-F.pdf?src-supplier=Diodes+Inc+SCT; ComponentLink7Description: https://sigma.octopart.com:443/138706058/technical_drawing/Diodes-Inc.-MMBD3004S-7-F.pdf?src-supplier=Diodes+Inc+SCT; ComponentLink8URL: https://datasheet.octopart.com:443/MMBD3004S-7-F-Diodes-Inc.-datasheet-14052017.pdf?src-supplier=iiiC; ComponentLink8Description: https://datasheet.octopart.com:443/MMBD3004S-7-F-Diodes-Inc.-datasheet-14052017.pdf?src-supplier=iiiC; ComponentLink9URL: https://datasheet.octopart.com:443/MMBD3004S-7-F-Diodes-Inc.-datasheet-11575602.pdf?src-supplier=Arrow+Electronics; ComponentLink9Description: https://datasheet.octopart.com:443/MMBD3004S-7-F-Diodes-Inc.-datasheet-11575602.pdf?src-supplier=Arrow+Electronics; ComponentLink10URL: https://datasheet.octopart.com:443/MMBD3004S-7-F-Diodes-Inc.-datasheet-10444908.pdf?src-supplier=Jameco; ComponentLink10Description: https://datasheet.octopart.com:443/MMBD3004S-7-F-Diodes-Inc.-datasheet-10444908.pdf?src-supplier=Jameco; ComponentLink11URL: http://sigma.octopart.com:80/15616899/materials_sheet/Diodes-Inc.-MMBD3004S-7-F.pdf?src-supplier=Compliance+Statements; ComponentLink11Description: http://sigma.octopart.com:80/15616899/materials_sheet/Diodes-Inc.-MMBD3004S-7-F.pdf?src-supplier=Compliance+Statements
D6 = CMP-14398-000037-1: DIODE SCHOTTKY 30V 200MA SOD323F; RoHS Compliant: Yes
DP1 = P6SMB150CA-E3/52: Trans Voltage Suppressor Diode, 600W, 128V V(RWM), Bidirectional, 1 Element, Silicon, DO-214AA; Manufacturer: Vishay; Breakdown Voltage: 150.5V; Clamping Voltage: 207V; Element Configuration: Single; Leakage Current: 1µA; Max Breakdown Voltage: 158V; Max Power Dissipation: 5W; Max Surge Current: 100A; Min Breakdown Voltage: 143V; Number of Channels: 1; Peak Pulse Current: 2.9A; Test Current: 1mA; Supplier: Mouser; Supplier Part Number: 625-P6SMB150CA-E3/52; Manufacturer Part Number: P6SMB150CA-E3/52; RoHS: Compliant; Category: TVS Diodes; Stock: 3965; Pricing: 1=0,4, 10=0,271, 50=0,271, 100=0,184, 1000=0,097, 10000=0,092 (USD); Case/Package: SMB; China RoHS: Non-Compliant; Country of Origin: Mainland China, Taiwan; Direction: Bidirectional; Export Control Classification Number (ECCN) Code: EAR99; Harmonized Tariff Schedule (HTS) Code: 8541.10.00.50; Introduction Date: 2002-04-10; Lifecycle Status: Production; Max Operating Temperature: 150°C; Max Reverse Leakage Current: 1µA; Min Operating Temperature: -65°C; Mounting Technology: Surface Mount; Number of Elements: 1; Pins: 2; Number of Terminals: 2; Operating Supply Voltage: 128V; Packaging: Tape & Reel; Peak Pulse Power: 600W; Peak Reverse Current: 1µA; Polarity: Bidirectional; Radiation Hardening: No; REACH SVHC: No; Reverse Breakdown Voltage: 143V; Reverse Standoff Voltage: 128V; Schedule B: 8541100080, 8541100080|8541100080|8541100080|8541100080|8541100080; ComponentLink1URL: https://datasheet.octopart.com:443/P6SMB150CA-E3-52-Vishay-datasheet-181470445.pdf?src-supplier=IHS; ComponentLink1Description: https://datasheet.octopart.com:443/P6SMB150CA-E3-52-Vishay-datasheet-181470445.pdf?src-supplier=IHS; ComponentLink2URL: https://datasheet.octopart.com:443/P6SMB150CA-E3-52-Vishay-datasheet-188933141.pdf?src-supplier=TME; ComponentLink2Description: https://datasheet.octopart.com:443/P6SMB150CA-E3-52-Vishay-datasheet-188933141.pdf?src-supplier=TME; ComponentLink3URL: https://datasheet.octopart.com:443/P6SMB150CA-E3-52-Vishay-datasheet-120074524.pdf?src-supplier=TME; ComponentLink3Description: https://datasheet.octopart.com:443/P6SMB150CA-E3-52-Vishay-datasheet-120074524.pdf?src-supplier=TME; ComponentLink4URL: https://datasheet.octopart.com:443/P6SMB150CA-E3-52-Vishay-datasheet-49916473.pdf?src-supplier=TME; ComponentLink4Description: https://datasheet.octopart.com:443/P6SMB150CA-E3-52-Vishay-datasheet-49916473.pdf?src-supplier=TME; ComponentLink5URL: https://datasheet.octopart.com:443/P6SMB150CA-E3-52-Vishay-datasheet-101751612.pdf?src-supplier=Future+Electronics; ComponentLink5Description: https://datasheet.octopart.com:443/P6SMB150CA-E3-52-Vishay-datasheet-101751612.pdf?src-supplier=Future+Electronics; ComponentLink6URL: http://sigma.octopart.com:80/rohs_statement/Vishay-company-15.pdf?src-supplier=Compliance+Statements; ComponentLink6Description: http://sigma.octopart.com:80/rohs_statement/Vishay-company-15.pdf?src-supplier=Compliance+Statements
DS1 = CMP-2000-05062-1: Chip LED, Green, 2.2 V, -40 to 85 degC, 2-Pin SMD, Pb-Free, Tape and Reel; Manufacturer: Avago; No. of Pins: 2; Peak Wavelength: 570nm; SVHC: NoSVHC(16-Jun-2014); Dominant Wavelength: 572nm; Forward Current If: 20mA; Viewing Angle: 170deg; Lens Shape: Rectangular; PIV Max: 5V; External Width: 1.25mm; LED Type: Standard; External Depth: 0.8mm; Opto Mounting Orientation: Top; Luminous Intensity: 15mcd; Luminous Intensity Min: 4mcd; Forward Voltage VF Max: 2.6V; External Length / Height: 2mm; Bulb Size: 1.25mmx1.4mm; Light Area Height: 1mm; Voltage Vf Typ: 2.2V; Operating Temperature Max: 85degC; Datasheet Version: Oct-08; MSL: MSL2A-4weeks; Peak Forward Current: 20mA; Package Description: 2-Pin Surface Mount Device, Body 2 x 1.25 mm, Height 0.8 mm; Datasheet URL: https://datasheet.ciiva.com/29280/180495-da-01-en-chip-led-hsmg-c170-gelb-gruen-29280971.pdf; Storage Temperature Min: -40degC; LED Colour: Green; Wavelength Typ: 570nm; Mounting Type: SMD; Forward Current If Max: 20mA; Dominant Wavelength Typ: 572nm; LED Mounting: SMD; Operating Temperature Range: -30degCto+85degC; Operating Temperature Min: -30degC; Manufacturer URL: http://www.avagotech.com/; Packaging: CutTape; Luminous Intensity Typ: 15mcd; Package Reference: HSMX-C170; Storage Temperature Max: 85degC; Opto Case Style: SMD; Forward Voltage: 2.2V
HS1-HS3 = V8813X: Heat Sink SOT-32, TO-220, TOP-3 Aluminum Board Level, Vertical; Manufacturer: ASSMANN WSW Components; Natural Thermal Resistance: 5°C/W; Shape: Fins, Rectangular; Designed by: YS; Supplier: Arrow Electronics; Supplier Part Number: V8813X; Manufacturer Part Number: V8813X; RoHS: Compliant; Category: Heat Sinks; Stock: 1200; Pricing: 1200=0,6825 (USD); Case/Package: SOT-32; Country of Origin: Mainland China, Taiwan; Depth: 12.5mm; Export Control Classification Number (ECCN) Code: EAR99; Height Off Base: 12.4968mm; Harmonized Tariff Schedule (HTS) Code: 8541.90.00.00; Introduction Date: 2018-05-22; Length: 34.5mm; Lifecycle Status: Production; Material: Aluminium; Mounting Technology: Bolt, PC Pin; Radiation Hardening: No; REACH SVHC: Yes; Schedule B: 8542900000, 8542900000|8542900000, 8542900000|8542900000|8542900000, 8542900000|8542900000|8542900000|8542900000; Type: Passive; Width: 34.5186mm; ComponentLink1URL: https://datasheet.octopart.com:443/V8813X-Assmann-Electronics-datasheet-169097868.pdf?src-supplier=IHS; ComponentLink1Description: https://datasheet.octopart.com:443/V8813X-Assmann-Electronics-datasheet-169097868.pdf?src-supplier=IHS; ComponentLink2URL: https://datasheet.octopart.com:443/V8813X-Assmann-Electronics-datasheet-62287351.pdf?src-supplier=Electro+Sonic; ComponentLink2Description: https://datasheet.octopart.com:443/V8813X-Assmann-Electronics-datasheet-62287351.pdf?src-supplier=Electro+Sonic
J1-J6 = 2501-2-00-80-00-00-07-0: Terminal Turret Connector Single End 0.219 (5.56mm) Tin; MF: Mill-Max Manufacturing; Check_prices: https://www.snapeda.com/parts/2501-2-00-80-00-00-07-0/Mill-Max+Manufacturing+Corp./view-part/?ref=eda; Value: *; Availability: In Stock; MP: 2501-2-00-80-00-00-07-0; Price: None; Package: None; SnapEDA_Link: https://www.snapeda.com/parts/2501-2-00-80-00-00-07-0/Mill-Max+Manufacturing+Corp./view-part/?ref=snap; Purchase-URL: https://pricing.snapeda.com/search/part/2501-2-00-80-00-00-07-0/?ref=eda
JP1 = NRPN022PAEN-RC: Board Connector, 4 Contact(s), 2 Row(s), Male, Straight, 0.079 inch Pitch, Solder Terminal; Manufacturer: Sullins; Connector Type: Male Pin; Contact Resistance: 20mΩ; Current Rating: 1A; Dielectric Material: Polyamide; Insulation Resistance: 5GΩ; Number of Positions: 4; Pitch: 2.0066mm; Supplier: Future Electronics; Supplier Part Number: NRPN022PAEN-RC; Manufacturer Part Number: NRPN022PAEN-RC; RoHS: Compliant; Category: Card Edge Connectors; Stock: 550; Pricing: 250=0,084, 750=0,0816, 2000=0,0796, 4000=0,0782, 12500=0,0743 (USD); Color: Black; Contact Mating Length: 3.5814mm; Contact Plating: Gold; Gender: Male; Lead Free: Lead Free; Lifecycle Status: Production; Max Operating Temperature: 105°C; Min Operating Temperature: -40°C; Mounting Technology: Through Hole; Number of Rows: 2; Packaging: Bulk; REACH SVHC: Yes; Row Spacing: 2.0066mm; Terminal Pitch: 2.0066mm; Termination: Solder; ComponentLink1URL: https://datasheet.octopart.com:443/NRPN022PAEN-RC-Sullins-datasheet-138898434.pdf?src-supplier=IHS; ComponentLink1Description: https://datasheet.octopart.com:443/NRPN022PAEN-RC-Sullins-datasheet-138898434.pdf?src-supplier=IHS; ComponentLink2URL: https://datasheet.octopart.com:443/NRPN022PAEN-RC-Sullins-datasheet-34148780.pdf?src-supplier=Future+Electronics; ComponentLink2Description: https://datasheet.octopart.com:443/NRPN022PAEN-RC-Sullins-datasheet-34148780.pdf?src-supplier=Future+Electronics; ComponentLink3URL: https://datasheet.octopart.com:443/NRPN022PAEN-RC-Sullins-datasheet-20918706.pdf?src-supplier=Future+Electronics; ComponentLink3Description: https://datasheet.octopart.com:443/NRPN022PAEN-RC-Sullins-datasheet-20918706.pdf?src-supplier=Future+Electronics; ComponentLink4URL: https://datasheet.octopart.com:443/NRPN022PAEN-RC-Sullins-datasheet-8329784.pdf?src-supplier=Future+Electronics; ComponentLink4Description: https://datasheet.octopart.com:443/NRPN022PAEN-RC-Sullins-datasheet-8329784.pdf?src-supplier=Future+Electronics
Q1 = IXTQ88N30P: PolarHT Series 300 V 88 A 40 mOhm Single N-Channel MOSFET - TO-3P; Manufacturer: Littelfuse; Continuous Drain Current (ID): 88A; Drain to Source Breakdown Voltage: 300V; Drain to Source Resistance: 40mΩ; Fall Time: 25ns; Gate to Source Voltage (Vgs): 20V; Input Capacitance: 6.3nF; Max Power Dissipation: 600W; Number of Elements: 1; Reverse Recovery Time: 250ns; Rise Time: 24ns; Threshold Voltage: 5V; Turn-Off Delay Time: 96ns; Designed by: YS; Supplier: Mouser; Supplier Part Number: 747-IXTQ88N30P; Manufacturer Part Number: IXTQ88N30P; RoHS: Compliant; Category: MOSFETs; Stock: 385; Pricing: 1=13,6, 10=9,14, 50=9,14, 100=9,14, 1000=7,89, 10000=7,89 (USD); China RoHS: Compliant; Drain to Source Voltage (Vdss): 300V; Export Control Classification Number (ECCN) Code: EAR99; Element Configuration: Single; Introduction Date: 2004-02-12; Lifecycle Status: Production; Max Operating Temperature: 150°C; Min Breakdown Voltage: 300V; Min Operating Temperature: -55°C; Mounting Technology: Through Hole; Pins: 3; Number of Terminals: 3; Power Dissipation: 600W; Rds On Max: 40mΩ; REACH SVHC: Yes; ComponentLink1URL: https://datasheet.octopart.com:443/IXTQ88N30P-IXYS-datasheet-141010746.pdf?src-supplier=IHS; ComponentLink1Description: https://datasheet.octopart.com:443/IXTQ88N30P-IXYS-datasheet-141010746.pdf?src-supplier=IHS; ComponentLink2URL: https://datasheet.octopart.com:443/IXTQ88N30P-Littelfuse-datasheet-180607954.pdf?src-supplier=IHS; ComponentLink2Description: https://datasheet.octopart.com:443/IXTQ88N30P-Littelfuse-datasheet-180607954.pdf?src-supplier=IHS; ComponentLink3URL: https://datasheet.octopart.com:443/IXTQ88N30P-IXYS-datasheet-5322258.pdf?src-supplier=Newark; ComponentLink3Description: https://datasheet.octopart.com:443/IXTQ88N30P-IXYS-datasheet-5322258.pdf?src-supplier=Newark; ComponentLink4URL: https://datasheet.octopart.com:443/IXTQ88N30P-IXYS-datasheet-176743126.pdf?src-supplier=Future+Electronics; ComponentLink4Description: https://datasheet.octopart.com:443/IXTQ88N30P-IXYS-datasheet-176743126.pdf?src-supplier=Future+Electronics; ComponentLink5URL: https://datasheet.octopart.com:443/IXTQ88N30P-IXYS-datasheet-10738099.pdf?src-supplier=iiiC; ComponentLink5Description: https://datasheet.octopart.com:443/IXTQ88N30P-IXYS-datasheet-10738099.pdf?src-supplier=iiiC